# Altium schematic sheet ChargerControl.SchDoc
size A3
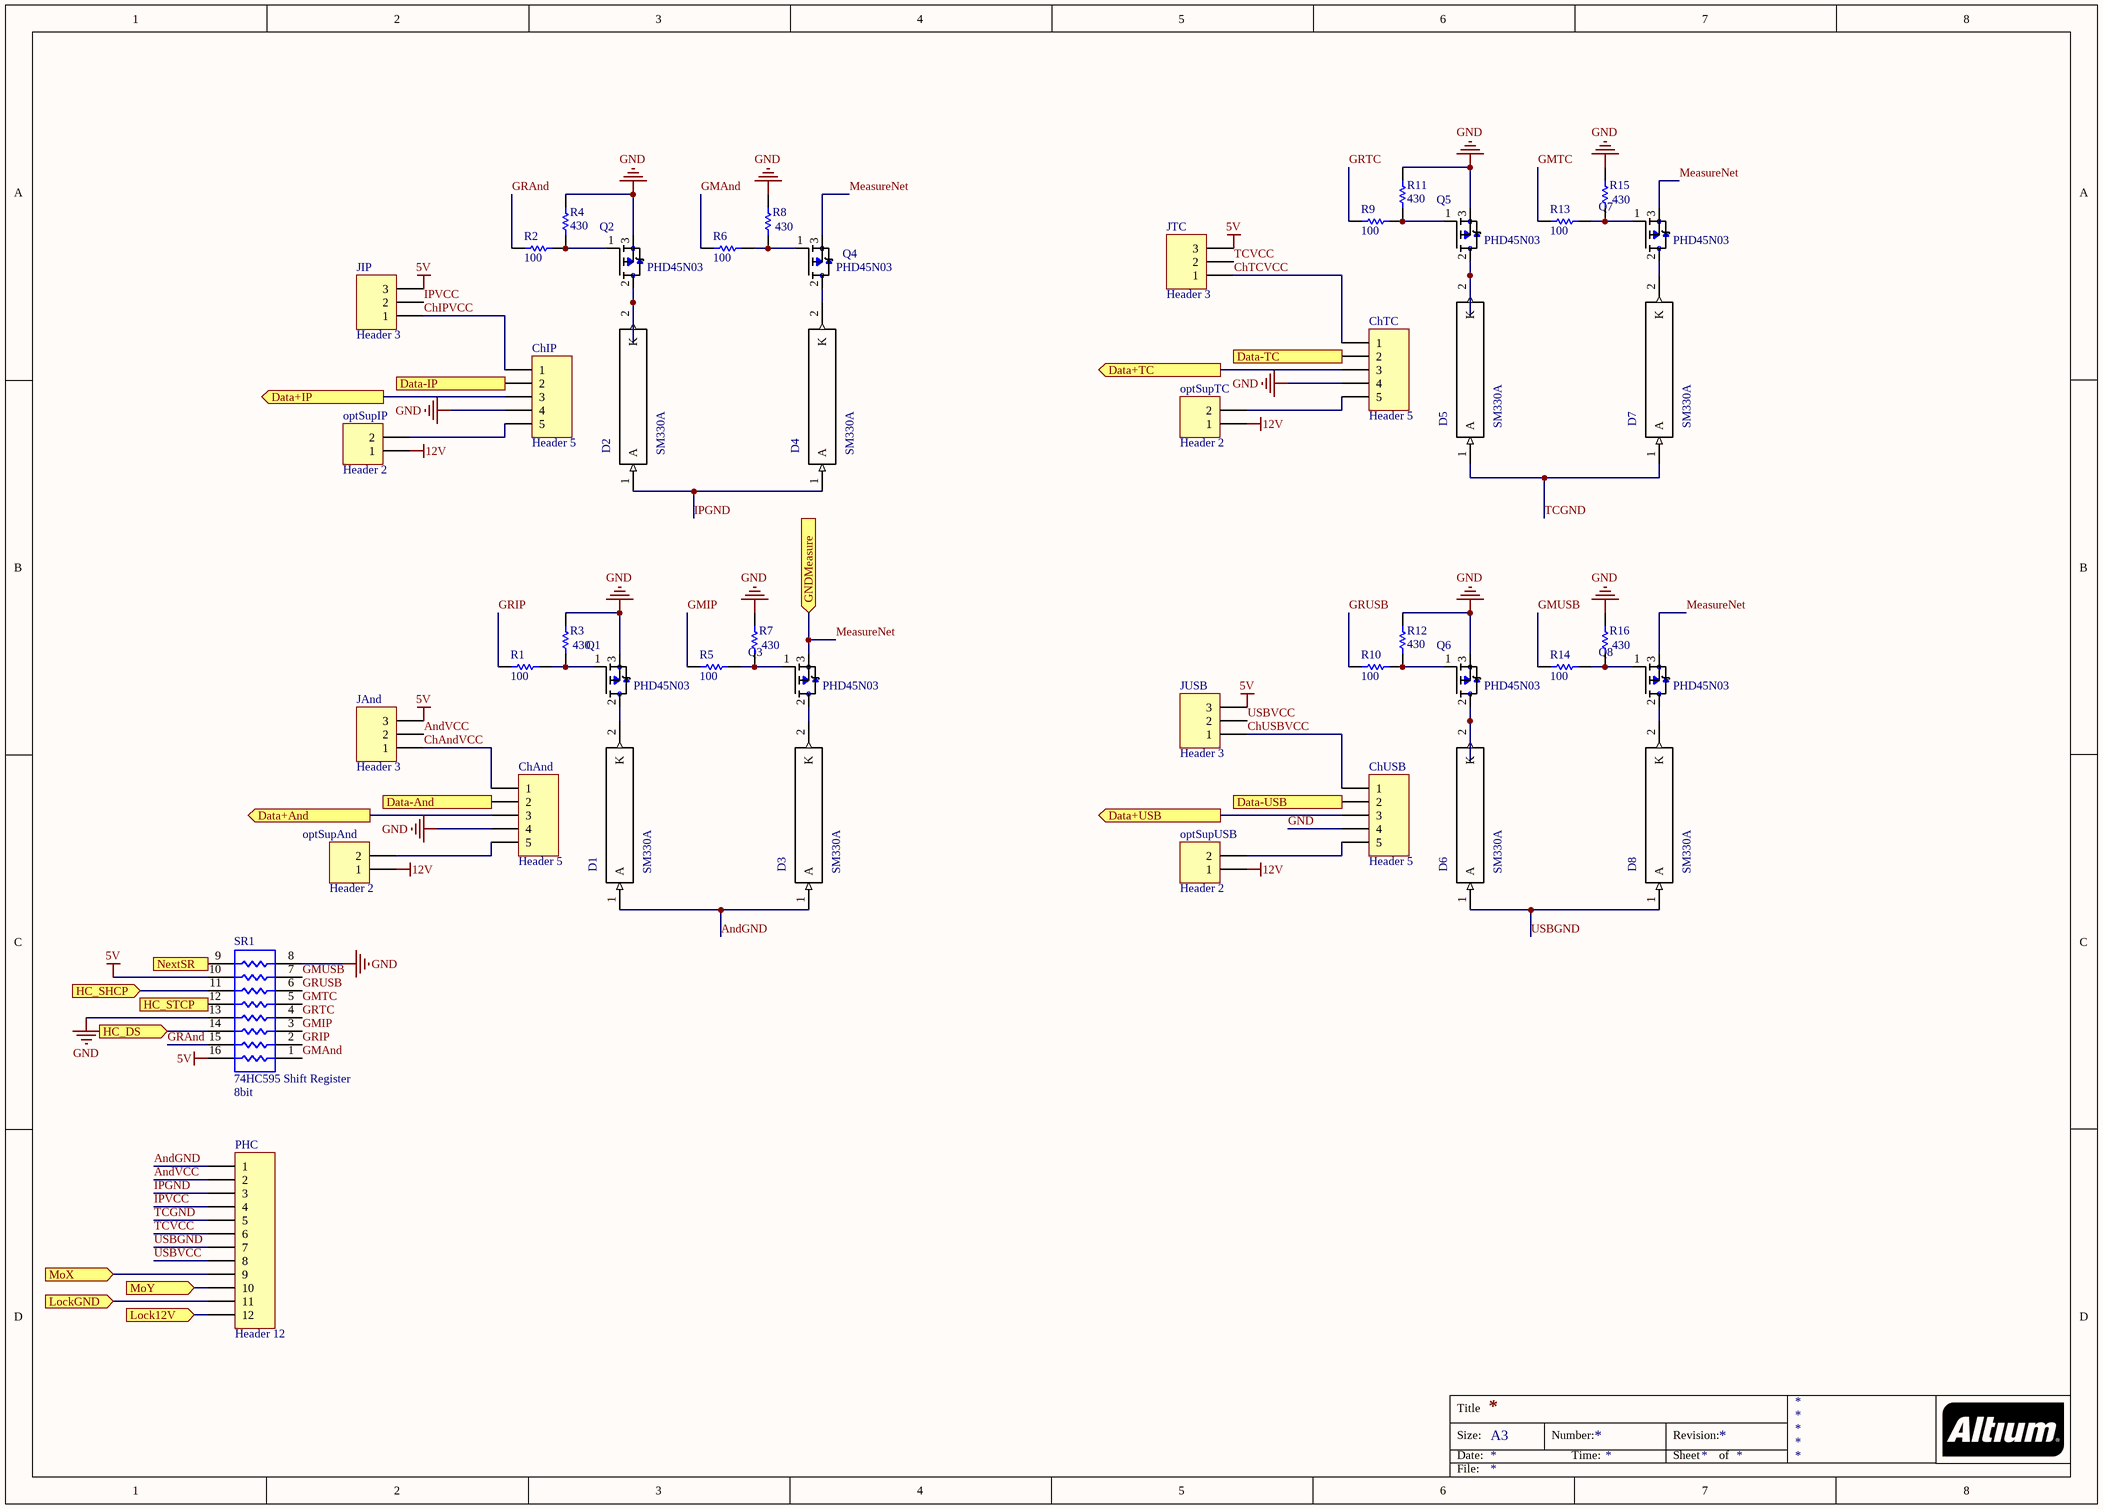
[diagram p0: ChargerControl.SchDoc]

## Parts
ChAnd  Header 5  [HDR1X5]
ChIP  Header 5  [HDR1X5]
ChTC  Header 5  [HDR1X5]
ChUSB  Header 5  [HDR1X5]
D1  SM330A  [*DIOM5227X270N_S1M(Primary)]
D2  SM330A  [*DIOM5227X270N_S1M(Primary)]
D3  SM330A  [*DIOM5227X270N_S1M(Primary)]
D4  SM330A  [*DIOM5227X270N_S1M(Primary)]
D5  SM330A  [*DIOM5227X270N_S1M(Primary)]
D6  SM330A  [*DIOM5227X270N_S1M(Primary)]
D7  SM330A  [*DIOM5227X270N_S1M(Primary)]
D8  SM330A  [*DIOM5227X270N_S1M(Primary)]
JAnd  Header 3  [HDR1X3]
JIP  Header 3  [HDR1X3]
JTC  Header 3  [HDR1X3]
JUSB  Header 3  [HDR1X3]
optSupAnd  Header 2  [HDR1X2]
optSupIP  Header 2  [HDR1X2]
optSupTC  Header 2  [HDR1X2]
optSupUSB  Header 2  [HDR1X2]
PHC  Header 12  [HDR1X12]
Q1  PHD45N03  [*DPAK228P998X235-3N]
Q2  PHD45N03  [*DPAK228P998X235-3N]
Q3  PHD45N03  [*DPAK228P998X235-3N]
Q4  PHD45N03  [*DPAK228P998X235-3N]
Q5  PHD45N03  [*DPAK228P998X235-3N]
Q6  PHD45N03  [*DPAK228P998X235-3N]
Q7  PHD45N03  [*DPAK228P998X235-3N]
Q8  PHD45N03  [*DPAK228P998X235-3N]
R1  value 100  [6-0805_L]  (hidden comment: R100)
R2  value 100  [6-0805_L]  (hidden comment: R100)
R3  value 430  [6-0805_L]  (hidden comment: R430)
R4  value 430  [6-0805_L]  (hidden comment: R430)
R5  value 100  [6-0805_L]  (hidden comment: R100)
R6  value 100  [6-0805_L]  (hidden comment: R100)
R7  value 430  [6-0805_L]  (hidden comment: R430)
R8  value 430  [6-0805_L]  (hidden comment: R430)
R9  value 100  [6-0805_L]  (hidden comment: R100)
R10  value 100  [6-0805_L]  (hidden comment: R100)
R11  value 430  [6-0805_L]  (hidden comment: R430)
R12  value 430  [6-0805_L]  (hidden comment: R430)
R13  value 100  [6-0805_L]  (hidden comment: R100)
R14  value 100  [6-0805_L]  (hidden comment: R100)
R15  value 430  [6-0805_L]  (hidden comment: R430)
R16  value 430  [6-0805_L]  (hidden comment: R430)
SR1  74HC595 Shift Register  value 8bit  [SO-16_L]

## Ports
Data+And (out), Data+IP (out), Data+TC (out), Data+USB (out), Data-And (out), Data-IP (out), Data-TC (out), Data-USB (out), GNDMeasure (in), HC_DS (in), HC_SHCP (in), HC_STCP (in), Lock12V (in), LockGND (in), MoX (in), MoY (in), NextSR (out)

## Nets
5V: JAnd.3 JIP.3 JTC.3 JUSB.3 SR1.10 SR1.16
12V: optSupAnd.1 optSupIP.1 optSupTC.1 optSupUSB.1
GND: ChAnd.4 ChIP.4 ChTC.4 ChUSB.4 Q1.3(S) Q2.3(S) Q5.3(S) Q6.3(S) R3.1 R4.1 R7.1 R8.1 R11.1 R12.1 R15.1 R16.1 SR1.8 SR1.13
AndGND: D1.1(A) D3.1(A) PHC.1
AndVCC: JAnd.2 PHC.2
ChAndVCC: ChAnd.1 JAnd.1
ChIPVCC: ChIP.1 JIP.1
ChTCVCC: ChTC.1 JTC.1
ChUSBVCC: ChUSB.1 JUSB.1
Data+And: ChAnd.3 ; port Data+And
Data+IP: ChIP.3 ; port Data+IP
Data+TC: ChTC.3 ; port Data+TC
Data+USB: ChUSB.3 ; port Data+USB
Data-And: ChAnd.2 ; port Data-And
Data-IP: ChIP.2 ; port Data-IP
Data-TC: ChTC.2 ; port Data-TC
Data-USB: ChUSB.2 ; port Data-USB
GMAnd: R6.1 SR1.1
GMIP: R5.1 SR1.3
GMTC: R13.1 SR1.5
GMUSB: R14.1 SR1.7
GRAnd: R2.1 SR1.15
GRIP: R1.1 SR1.2
GRTC: R9.1 SR1.4
GRUSB: R10.1 SR1.6
HC_DS: SR1.14 ; port HC_DS
HC_SHCP: SR1.11 ; port HC_SHCP
HC_STCP: SR1.12 ; port HC_STCP
IPGND: D2.1(A) D4.1(A) PHC.3
IPVCC: JIP.2 PHC.4
Lock12V: PHC.12 ; port Lock12V
LockGND: PHC.11 ; port LockGND
MeasureNet: Q3.3(S) Q4.3(S) Q7.3(S) Q8.3(S) ; port GNDMeasure
MoX: PHC.9 ; port MoX
MoY: PHC.10 ; port MoY
NextSR: SR1.9 ; port NextSR
TCGND: D5.1(A) D7.1(A) PHC.5
TCVCC: JTC.2 PHC.6
USBGND: D6.1(A) D8.1(A) PHC.7
USBVCC: JUSB.2 PHC.8
NetChAnd_5: ChAnd.5 optSupAnd.2
NetChIP_5: ChIP.5 optSupIP.2
NetChTC_5: ChTC.5 optSupTC.2
NetChUSB_5: ChUSB.5 optSupUSB.2
NetD1_2: D1.2(K) Q1.2(D)
NetD2_2: D2.2(K) Q2.2(D)
NetD3_2: D3.2(K) Q3.2(D)
NetD4_2: D4.2(K) Q4.2(D)
NetD5_2: D5.2(K) Q5.2(D)
NetD6_2: D6.2(K) Q6.2(D)
NetD7_2: D7.2(K) Q7.2(D)
NetD8_2: D8.2(K) Q8.2(D)
NetQ1_1: Q1.1(G) R1.2 R3.2
NetQ2_1: Q2.1(G) R2.2 R4.2
NetQ3_1: Q3.1(G) R5.2 R7.2
NetQ4_1: Q4.1(G) R6.2 R8.2
NetQ5_1: Q5.1(G) R9.2 R11.2
NetQ6_1: Q6.1(G) R10.2 R12.2
NetQ7_1: Q7.1(G) R13.2 R15.2
NetQ8_1: Q8.1(G) R14.2 R16.2

## Notes on the sheet
- Title
- Size:
- Date:
- A3
- Number:
- Time:
- Revision:
- Sheet
- of
- File:

## Library data of the parts
ChAnd ChIP ChTC ChUSB = Header 5: ورودی از شارژر اندرویید; LatestRevisionDate: 17-Jul-2002; LatestRevisionNote: Re-released for DXP Platform.; Publisher: Altium Limited
D1-D8 = STPS2L60A: SCHOTTKY RECTIFIER 2A; Voltage Vrrm: 60V; Diode Case Style: DO-214AC; Case Style: DO-214AC; pin to pad: 1>A 2>A; MF: STMicroelectronics; Price: None; Availability: Unavailable; SnapEDA_Link: https://www.snapeda.com/parts/STPS2L60A/STMicroelectronics/view-part/?ref=snap; Package: DO-214 STMicroelectronics; MP: STPS2L60A; Value: *
JAnd JIP JTC JUSB = Header 3: جامپر انتخاب بین 5 ثابت خروجی (منبع تغذیه ثابت) یا انتخاب خروجی شارژر برای قفسه; LatestRevisionDate: 17-Jul-2002; LatestRevisionNote: Re-released for DXP Platform.; Publisher: Altium Limited
optSupAnd optSupIP optSupTC optSupUSB = Header 2: اگر شارژر ورودی 12 ولت داشته باشد این جامپر 12 ولت بایستی وصل شود; LatestRevisionDate: 17-Jul-2002; LatestRevisionNote: Re-released for DXP Platform.; Publisher: Altium Limited
PHC = Header 12: Header, 12-Pin; LatestRevisionDate: 17-Jul-2002; LatestRevisionNote: Re-released for DXP Platform.; Publisher: Altium Limited
Q1-Q8 = IPD50P04P4L-11: P-Channel 40 V 10.6 mOhm OptiMOSآ®-P2 Power-Transistor -PG-TO-252-3; MF: Infineon Technologies; MP: IPD50P04P4L-11; Package: TO-252-3 Infineon; Price: None; Availability: Unavailable; SnapEDA_Link: https://www.snapeda.com/parts/IPD50P04P4L-11/Infineon%20Technologies/view-part/?ref=snap; Value: *
R1-R16 = Res1: Resistor; Published: 8-Jun-2000; LatestRevisionDate: 17-Jul-2002; LatestRevisionNote: Re-released for DXP Platform.; PackageReference: AXIAL-0.3; Publisher: Altium Limited; PackageDescription: Axial Device, Thru-Hole; 2 Leads; 0.3 in Pin Spacing
SR1 = Res Pack3: Isolated Resistor Network; Published: 24-Mar-1999; LatestRevisionDate: 29-May-2009; LatestRevisionNote: IPC-7351 Footprint Added.; PackageReference: SO-16; Publisher: Altium Limited; PackageDescription: 16-Pin Small Outline Integrated Circuit 1.27 mm Pitch; Code_JEDEC: MS-012-AC; Code_IPC: SOIC127P600-16